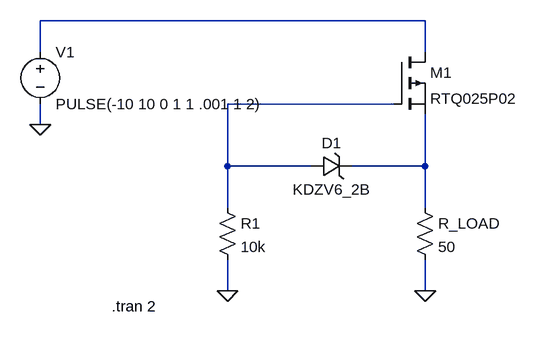
[diagram p0: schematic ProtectInversPolarite.asc]
ProtectInversPolarite.asc, the LTspice schematic file:
Version 4
SHEET 1 880 680
WIRE 336 16 -256 16
WIRE -256 64 -256 16
WIRE 336 64 336 16
WIRE 288 144 32 144
WIRE -256 176 -256 144
WIRE 32 240 32 144
WIRE 160 240 32 240
WIRE 336 240 336 160
WIRE 336 240 224 240
WIRE 32 304 32 240
WIRE 336 304 336 240
WIRE 32 432 32 384
WIRE 336 432 336 384
FLAG -256 176 0
FLAG 32 432 0
FLAG 336 432 0
SYMBOL pmos 288 64 R0
SYMATTR InstName M1
SYMATTR Value RTQ025P02
SYMBOL voltage -256 48 R0
WINDOW 123 0 0 Left 0
WINDOW 39 0 0 Left 0
SYMATTR InstName V1
SYMATTR Value PULSE(-10 10 0 1 1 .001 1 2)
SYMBOL res 16 288 R0
SYMATTR InstName R1
SYMATTR Value 10k
SYMBOL zener 160 256 R270
WINDOW 0 36 32 VTop 2
WINDOW 3 -4 32 VBottom 2
SYMATTR InstName D1
SYMATTR Value KDZV6_2B
SYMBOL res 320 288 R0
SYMATTR InstName R_LOAD
SYMATTR Value 50
TEXT -146 456 Left 2 !.tran 2

The netlist it stands for:
* ProtectInversPolarite.asc
M1 N001 N002 N003 N003 RTQ025P02
V1 N001 0 PULSE(-10 10 0 1 1 .001 1 2)
R1 N002 0 10k
D1 N002 N003 KDZV6_2B
R_LOAD N003 0 50
.model D D
.lib standard.dio
.model NMOS NMOS
.model PMOS PMOS
.lib standard.mos
.tran 2
.backanno
.end